# EAGLE design arduinoshield (EAGLE 9.3.0)
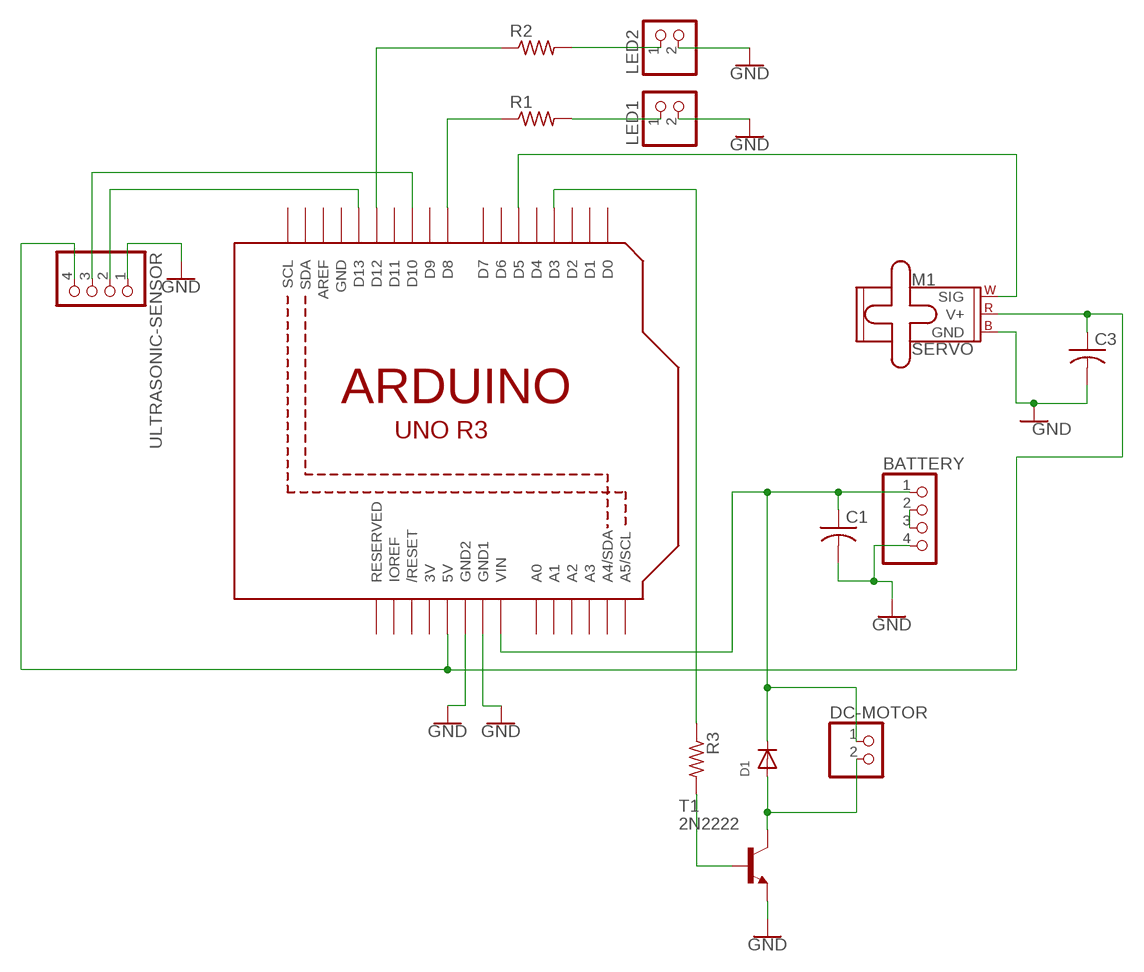
[diagram p0: schematic, sheet 1]

## Parts
BATTERY  PINHD-1X4  [1X04]
C1  C-US025-025X050  [C025-025X050]
C3  C-US025-025X050  [C025-025X050]
D1  DIODEDO-1N4148  [DO-1N4148]
DC-MOTOR  PINHD-1X2  [1X02]
LED1  PINHD-1X2  [1X02]
LED2  PINHD-1X2  [1X02]
M1  SERVO  [1X03]
R1  R-US_0204/5  [0204/5]
R2  R-US_0204/5  [0204/5]
R3  R-US_0204/5  [0204/5]
T1  2N2222  [TO92-EBC-OVAL]
U1  ARDUINOR3-BPLACE  [ARDUINOR3-BPLACE]
ULTRASONIC-SENSOR  PINHD-1X4  [1X04]

## Nets
GND: BATTERY.4 C1.2 C3.2 LED1.2 LED2.2 M1.3(GND) T1.E U1.GND1 U1.GND2 ULTRASONIC-SENSOR.1
MOOTTORI: C3.1 M1.2(V+) U1.5V ULTRASONIC-SENSOR.4
N$1: R1.1 U1.D8
N$2: LED1.1 R1.2
N$3: M1.1(SIG) U1.D5
N$4: R2.1 U1.D12
N$5: BATTERY.2 BATTERY.3
N$6: LED2.1 R2.2
N$7: U1.D13 ULTRASONIC-SENSOR.2
N$8: U1.D10 ULTRASONIC-SENSOR.3
N$9: R3.1 U1.D3
N$10: R3.2 T1.B
N$13: D1.A DC-MOTOR.2 T1.C
N$14: BATTERY.1 C1.1 D1.C DC-MOTOR.1 U1.VIN
Unconnected: U1.A0 U1.A1 U1.A2 U1.A3 U1.A4(A4/SDA) U1.A5(A5/SCL) U1.AREF U1.D0 U1.D1 U1.D2 U1.D4 U1.D6 U1.D7 U1.D9 U1.D11 U1.IOREF U1.RESERVED U1.RESET(/RESET) U1.SCL U1.SDA

## Power pins joined to a net without a drawn wire
3V: U1.3V
GND: U1.GND

## Library data of the parts
BATTERY ULTRASONIC-SENSOR = pinhead:PINHD-1X4: PIN HEADER
C1 C3 = adafruit:C-US: CAPACITOR, American symbol
D1 = adafruit:DIODE: Diode SMADIODE - SMA Surface Mount Package 20V 1A Schottky Diode Digikey: 641-1014-6-ND DO-1N4148 - Through Hole Small Current Diode SOD-123 20V 1 A (.5mV Vf) Schottky Diode - Digikey: MBRX120TPMSCT-ND SOD-323 10V 570mA (.38mV Vf, 3ns) Schottky Diode - Digikey: ZLLS410CT-ND SOD-523 30V 30mA Schottky Diode (RB751S-40TE61) - Digikey: RB751S-40TE61CT-ND SOT23-R/W - SOT23 Package (R = Solder Paste/Reflow Ovens, W = Hand-Soldering) BAT54Film 40V 300mA - Digikey: 497-7162-1-ND
DC-MOTOR LED1 LED2 = pinhead:PINHD-1X2: PIN HEADER
M1 = SparkFun-Electromechanical:SERVO: Servo Motor 3-pin connector for a standard servo motor (voltage supply, ground, and control signal.) SparkFun Products Servo - Generic (Sub-Micro Size) <https://www.sparkfun.com/products/9065> (ROB-09065) Servo - Generic High Torque Continuous Rotation (Standard Size) <https://www.sparkfun.com/products/9347> (ROB-09347) Servo - Generic High Torque (Standard Size) <https://www.sparkfun.com/products/11965> (ROB-11965)
R1-R3 = adafruit:R-US_: RESISTOR, American symbol
T1 = adafruit:2N2222: NPN TRANSISTOR Big oval pads
U1 = adafruit:ARDUINOR3: This is a new object for the new Arduino R3 - with extra pins that you may want to use (such as IOref, and duplicated A4/A5

## Board
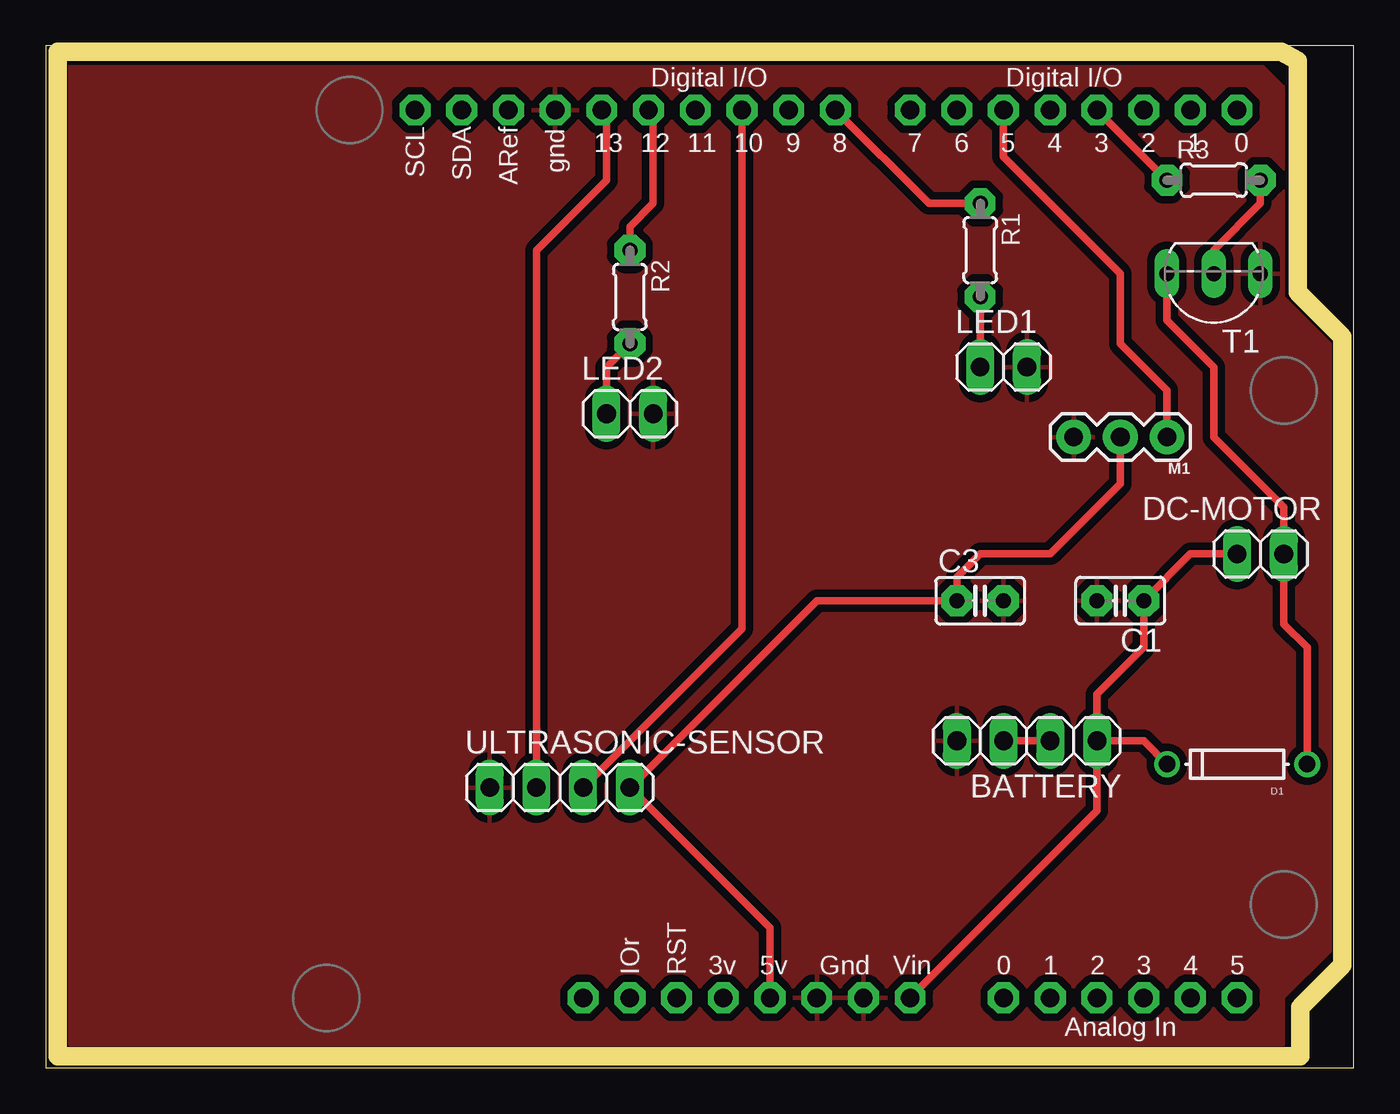
[diagram p1: board, top side]
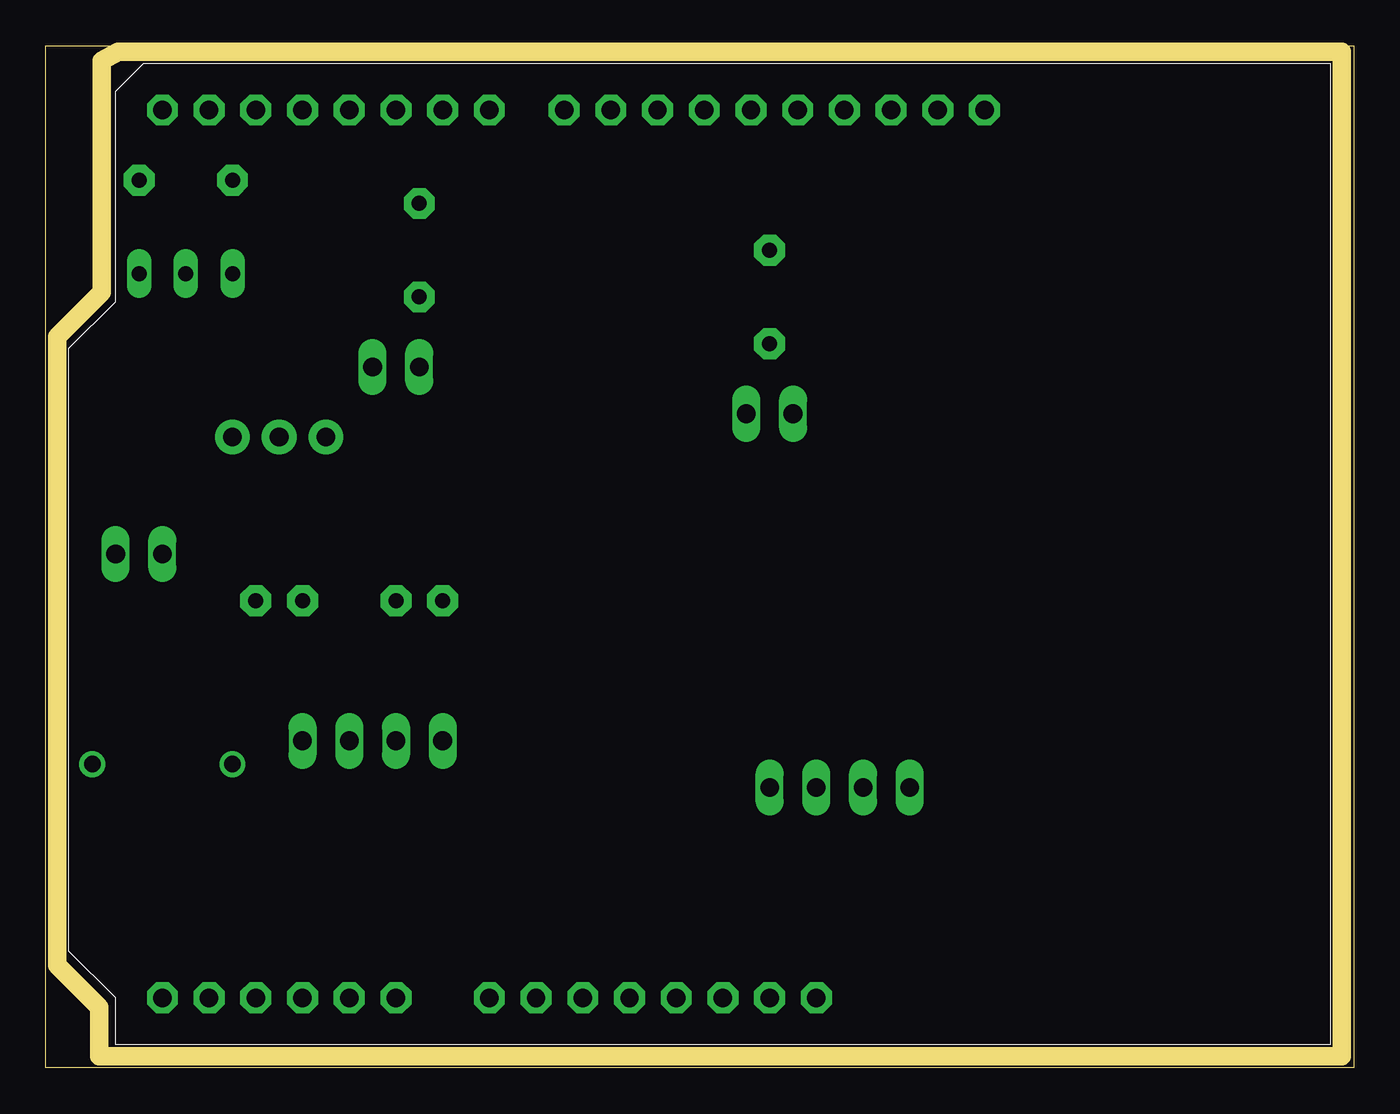
[diagram p2: board, bottom side, seen from below]

Size 71.1 x 55.55 mm. Coordinates in mm from the lower left corner, seen from the top.
Outline: 0,0 71.1,0 71.1,55.55 0,55.55 0,0
Copper layers (1*16): Top 0.035mm / dielectric 1.5mm / Bottom 0.035mm
Design rules "default *": minimum track width 16mil, minimum drill 0.35mm, track to track 16mil, track to pad 16mil, pad to pad 16mil, via to via 16mil, smd to smd 16mil, copper to edge 40mil, drill to drill 6mil, minimum pad ring 10mil, minimum via ring 8mil, stop-mask expansion 4mil, vias tented up to drill 0mil, thermal gap 16mil
Milling: 9 lines

### Footprints (pad centres in the part's own frame; a part is rotated, then mirrored left to right if it is on the bottom)
1X04 = drill 1.016 long: 1 -3.81,0; 2 -1.27,0; 3 1.27,0; 4 3.81,0
C025-025X050 = drill 0.813 pad 1.676 octagon: 1 -1.27,0; 2 1.27,0
DO-1N4148 = drill 0.9: A -3.81,0; C 3.81,0
1X02 = drill 1.016 long: 1 -1.27,0; 2 1.27,0
1X03 = drill 1.016 pad 1.88: 1 0,0; 2 2.54,0; 3 5.08,0
0204/5 = drill 0.813 pad 1.676 octagon: 1 -2.54,0; 2 2.54,0
TO92-EBC-OVAL = drill 0.813 long: B 0,-1.27; C 2.54,-1.27; E -2.54,-1.27
ARDUINOR3-BPLACE = drill 1 pad 1.676 octagon: 3V 35.56,2.54; 5V 38.1,2.54; A0 50.8,2.54; A1 53.34,2.54; A2 55.88,2.54; A3 58.42,2.54; A4 60.96,2.54; A5 63.5,2.54; AREF 23.876,50.8; D0 63.5,50.8; D1 60.96,50.8; D2 58.42,50.8; D3 55.88,50.8; D4 53.34,50.8; D5 50.8,50.8; D6 48.26,50.8; D7 45.72,50.8; D8 41.656,50.8; D9 39.116,50.8; D10 36.576,50.8; D11 34.036,50.8; D12 31.496,50.8; D13 28.956,50.8; GND 26.416,50.8; GND1 43.18,2.54; GND2 40.64,2.54; IOREF 30.48,2.54; RESERVED 27.94,2.54; RESET 33.02,2.54; SCL 18.796,50.8; SDA 21.336,50.8; VIN 45.72,2.54

### Placement (x,y rotation side)
BATTERY  53.34,17.78 180 top
C1  58.42,25.4 180 top
C3  50.8,25.4 0 top
D1  64.77,16.51 180 top
DC-MOTOR  66.04,27.94 0 top
LED1  52.07,38.1 0 top
LED2  31.75,35.56 0 top
M1  60.96,34.29 180 top
R1  50.8,44.45 270 top
R2  31.75,41.91 270 top
R3  63.5,48.26 0 top
T1  63.5,41.91 180 top
U1  1.27,1.27 0 top
ULTRASONIC-SENSOR  27.94,15.24 0 top

### Tracks (layer width: path | path; a pad name or v marks a point on that pad's centre or on a via)
GND
  pour Top: 1.27,54.61 1.27,1.27 67.31,1.27 67.31,3.81 69.85,6.35 69.85,39.37 67.31,41.91 67.31,53.34 66.04,54.61
MOOTTORI
  Top 0.406: M1.2 58.42,31.75 54.61,27.94 50.8,27.94 49.53,26.67 C3.1 41.91,25.4 ULTRASONIC-SENSOR.4 39.37,7.62 U1.5V
N$1
  Top 0.406: U1.D8 48.01,46.99 R1.1
N$2
  Top 0.406: R1.2 LED1.1
N$3
  Top 0.406: U1.D5 52.07,49.53 58.42,43.18 58.42,39.37 60.96,36.83 M1.1
N$4
  Top 0.406: R2.1 31.75,45.72 33.02,46.99 33.02,51.82 U1.D12
N$5
  Top 0.406: BATTERY.3 BATTERY.2
N$6
  Top 0.406: LED2.1 30.48,38.1 R2.2
N$7
  Top 0.406: U1.D13 30.48,51.82 30.48,48.26 26.67,44.45 ULTRASONIC-SENSOR.2
N$8
  Top 0.406: ULTRASONIC-SENSOR.3 37.85,23.88 U1.D10
N$9
  Top 0.406: U1.D3 R3.1
N$10
  Top 0.406: R3.2 66.04,46.99 63.5,44.45 T1.B
N$13
  Top 0.406: T1.C 60.96,40.64 63.5,38.1 63.5,34.29 67.31,30.48 DC-MOTOR.2 67.31,24.13 68.58,22.86 D1.A
N$14
  Top 0.406: DC-MOTOR.1 62.23,27.94 C1.1 59.69,22.86 57.15,20.32 BATTERY.1 | BATTERY.1 59.69,17.78 D1.C | U1.VIN 57.15,13.97 BATTERY.1